# Altium schematic sheet Sheet2.SchDoc
size A4; SheetNumber: 1; SheetTotal: 1
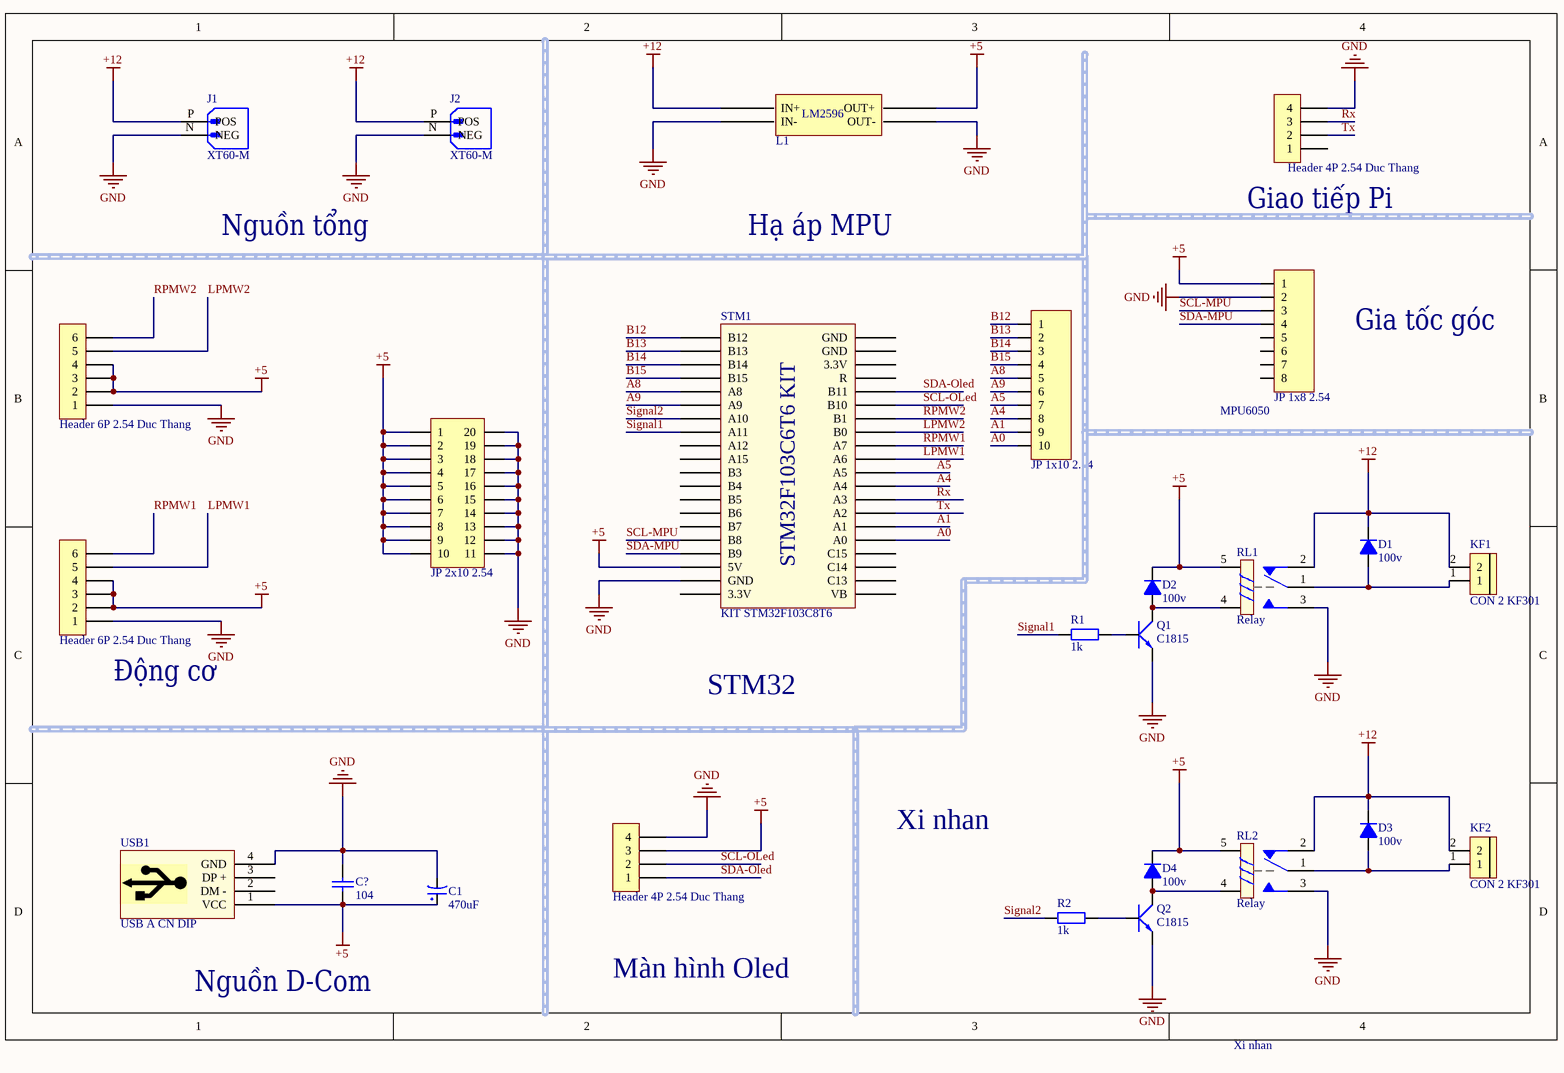
[diagram p0: Sheet2.SchDoc]

## Parts
(Parts that share a designator on the sheet are numbered #1, #2 ... from top to bottom, then left to right.)
C1  470uF  [tu hoa 8mm]
C?  104  [tu gom]
D1  100v  [DIODE 1A]
D2  100v  [DIODE 1A]
D3  100v  [DIODE 1A]
D4  100v  [DIODE 1A]
DC1  Header 6P 2.54 Duc Thang  [XH2.54M-6]
DC2  Header 6P 2.54 Duc Thang  [XH2.54M-6]
J1  XT60-M  [AMASS_XT60-M]
J2  XT60-M  [AMASS_XT60-M]
JP?#1  JP 1x10 2.54  [JP 1x10 DT]
JP?#2  JP 2x10 2.54  [JP 2x10 CT]
KF1  CON 2 KF301  [Con 2 KF301 5.08]
KF2  CON 2 KF301  [Con 2 KF301 5.08]
L1  BUCK_LM2596  [BUCK_LM2596]  (value not drawn)
MPU6050  JP 1x8 2.54  [JP 1x8 DT]
OLed  Header 4P 2.54 Duc Thang  [XH2.54M-4]
Q1  C1815  [TO92]
Q2  C1815  [TO92]
R1  1k  [tro vach 1/4w]
R2  1k  [tro vach 1/4w]
RL1  Relay  [Relay 5 Chan SRD]
RL2  Relay  [Relay 5 Chan SRD]
STM1  KIT STM32F103C8T6  [STM32F103 KIT]
UART  Header 4P 2.54 Duc Thang  [XH2.54M-4]
USB1  USB A CN DIP  [USB A CN DIP]

## Nets
+5: C1.1 C?.2 D2.2(K) D4.2(K) DC1.2 DC1.3 DC1.4 DC2.2 DC2.3 DC2.4 JP?#2.1 JP?#2.2 JP?#2.3 JP?#2.4 JP?#2.5 JP?#2.6 JP?#2.7 JP?#2.8 JP?#2.9 JP?#2.10 L1.4(OUT+) MPU6050.1 OLed.3 RL1.5 RL2.5 STM1.18(5V) USB1.1(VCC)
+12: D1.2(K) D3.2(K) J1.P(POS) J2.P(POS) KF1.2 KF2.2 L1.1(IN+) RL1.2 RL2.2
GND: C1.2 C?.1 DC1.1 DC2.1 J1.N(NEG) J2.N(NEG) JP?#2.11 JP?#2.12 JP?#2.13 JP?#2.14 JP?#2.15 JP?#2.16 JP?#2.17 JP?#2.18 JP?#2.19 JP?#2.20 L1.2(IN-) L1.3(OUT-) MPU6050.2 OLed.4 Q1.1(E) Q2.1(E) RL1.3 RL2.3 STM1.19(GND) UART.4 USB1.4(GND)
A0: JP?#1.10 STM1.25(A0)
A1: JP?#1.9 STM1.26(A1)
A4: JP?#1.8 STM1.29(A4)
A5: JP?#1.7 STM1.30(A5)
A8: JP?#1.5 STM1.5(A8)
A9: JP?#1.6 STM1.6(A9)
B12: JP?#1.1 STM1.1(B12)
B13: JP?#1.2 STM1.2(B13)
B14: JP?#1.3 STM1.3(B14)
B15: JP?#1.4 STM1.4(B15)
LPMW1: DC1.5 STM1.31(A6)
LPMW2: DC2.5 STM1.33(B0)
RPMW1: DC1.6 STM1.32(A7)
RPMW2: DC2.6 STM1.34(B1)
Rx: STM1.28(A3) UART.3
SCL-MPU: MPU6050.3 STM1.16(B8)
SCL-OLed: OLed.2 STM1.35(B10)
SDA-MPU: MPU6050.4 STM1.17(B9)
SDA-Oled: OLed.1 STM1.36(B11)
Signal1: R1.1 STM1.8(A11)
Signal2: R2.1 STM1.7(A10)
Tx: STM1.27(A2) UART.2
NetD1_1: D1.1(A) KF1.1 RL1.1
NetD2_1: D2.1(A) Q1.2(C) RL1.4
NetD3_1: D3.1(A) KF2.1 RL2.1
NetD4_1: D4.1(A) Q2.2(C) RL2.4
NetQ1_3: Q1.3(B) R1.2
NetQ2_3: Q2.3(B) R2.2

Not connected (* = marked no-connect by the designer): MPU6050 5 6 7 8; STM1 9(A12) 10(A15) 11(B3) 12(B4) 13(B5) 14(B6) 15(B7) 20(3.3V) 21(VB) 22(C13) 23(C14) 24(C15) 37(R) 38(3.3V) 39(GND) 40(GND); UART 1; USB1 2(DM_-) 3(DP_+)

## Notes on the sheet
- Nguồn tổng
- Hạ áp MPU
- (near UART) Giao tiếp Pi
- Gia tốc góc
- (near MPU6050) MPU6050
- (near DC1) Động cơ
- STM32
- Xi nhan
- Nguồn D-Com
- Màn hình Oled
- (in symbol BUCK_LM2596) LM2596
- (in symbol STM32f103 Bluepill) STM32F103C6T6 KIT

## Library data of the parts
C1 = Tu Hoa 470uF 25V 8x13: Cắm; Don_Vi: Con; So_Chan: 2; Ten_Linh_Kien: Tụ Hóa 470uF 25V; Ma_Hang: MH 470uF 25V; Chung_Loai: Cắm; Kieu_Chan: *
C? = Tu gom 104 50V: Cắm; So_Chan: 2; Ten_Linh_Kien: Tụ gốm 104 100nF 50V; Don_Vi: Con; Ma_Hang: MH004761; Chung_Loai: Cắm; Kieu_Chan: *
D1-D4 = Diode 1N4007: Cắm; Ten_Linh_Kien: Diode 1N4007 1A (DIP); Don_Vi: Con; Ma_Hang: MH001063; Ghi Chu: *; Kieu_Chan: *; Chung_Loai: Cắm
DC1 DC2 = Header 6P 2.54 Duc Thang: Cắm; Ten_Linh_Kien: Header 6P XH2.54-6P Đực Thẳng; Don_Vi: Con; Ma_Hang: MH001972; Chung_Loai: Cắm
J1 J2 = XT60-M: Plug; DC supply; XT60; male; PIN: 2; for cable; soldered; 30A; 500V; MF: AMASS; SnapEDA_Link: https://www.snapeda.com/parts/XT60-M/AMASS/view-part/?ref=snap; Package: Package; Value: *; MP: XT60-M; Check_prices: https://www.snapeda.com/parts/XT60-M/AMASS/view-part/?ref=eda
JP?#1 = JP 1x10 2.54 Duc Thang: Cắm; Ten_Linh_Kien: Jump Đơn Đực 2.54MM 1x40P Thẳng 11MM; Don_Vi: Con; Ma_Hang: MH000903; Ghi_Chu: *; Kieu_Chan: *; Chung_Loai: Cắm
JP?#2 = JP 2x10 2.54 Cai Thang: Cắm; Ten_Linh_Kien: Jump Đôi Cái 2.54MM 2x20P Thẳng; Don_Vi: Con; Ma_Hang: MH008647; Ghi_Chu: *; Kieu_Chan: *; Chung_Loai: Cắm
KF1 KF2 = CON 2 KF301: Cắm; Ma_Hang: MH000987; Ten_Linh_Kien: CON 2 KF301-2P 5.08MM Xanh Dương; Chung_Loai: Cắm; Ghi_Chu: *; Kieu_Chan: *; Don_Vi: Con
MPU6050 = JP 1x8 2.54 Duc Thang: Cắm; Ten_Linh_Kien: Jump Đơn Đực 2.54MM 1x40P Thẳng 11MM; Don_Vi: Con; Ma_Hang: MH000903; Ghi_Chu: *; Kieu_Chan: *; Chung_Loai: Cắm
OLed UART = Header 4P 2.54 Duc Thang: Cắm; Ten_Linh_Kien: Header 4P XH2.54-4P Đực Thẳng; Don_Vi: Con; Ma_Hang: MH001285; Chung_Loai: Cắm
Q1 Q2 = Trans C1815 DIP: NPN transistor; Value: C9014
R1 R2 = Tro Vach 1/4w 5% 5.1k: Cắm; Don_Vi: Con; So_Chan: 2; Ten_Linh_Kien: Trở Vạch 1/4w 5% 5.1k; Ma_Hang: MH007322; Chung_Loai: Cắm; Kieu_Chan: *
RL1 RL2 = Relay 5 Chan SRD: Relay 5 Chan; Ma_Hang: MH009374; Ten: Relay 5V10A SRD-05VDC-SL-C Chính Hãng
STM1 = STM32f103 Bluepill: KIT STM32F103C8T6 Bluepill
USB1 = USB A CN DIP: USB Type A; Ten: USB A Cái DIP; Ma_Hang: MH000941